# EAGLE design THAT15xx_lean (EAGLE 9.6.2)
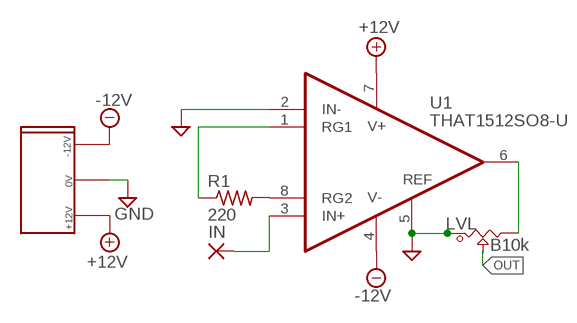
[diagram p0: schematic, sheet 1]

## Parts
IN  WIREPADSMD5-1,8  [5-1,8]
LVL  B10k  POT_9MM_SMD  [POT_9MM_SMD]
R1  220  R-US_R0603  [R0603]
U1  THAT1512SO8-U  [SO08]
U$1  EURO_POW_CEH  [EURO_POW_CEH]

## Nets
15XXO: LVL.3 U1.6(OUT)
+12V: U1.7(V+) U$1.+12V
-12V: U1.4(V-) U$1.-12V
GND: LVL.1 U1.2(IN-) U1.5(REF) U$1.GND
IN: IN.1(P) U1.3(IN+)
N$1: R1.2 U1.8(RG2)
N$2: R1.1 U1.1(RG1)
OUT: LVL.2

## Library data of the parts
IN = wirepad:WIREPAD: Wire PAD connect wire on PCB
LVL = Mech_BO_CE_SW:POT_9MM_SMD
R1 = adafruit:R-US_: RESISTOR, American symbol
U1 = that-corp:THAT1512: Audio Preamplifier IC, Low Noise, High Performance
U$1 = 2.54mm_PowHeader_SMD:EURO_POW_CEH: Eurorack Power Header Reduced Card Edge Surface Mount Pads

## Board
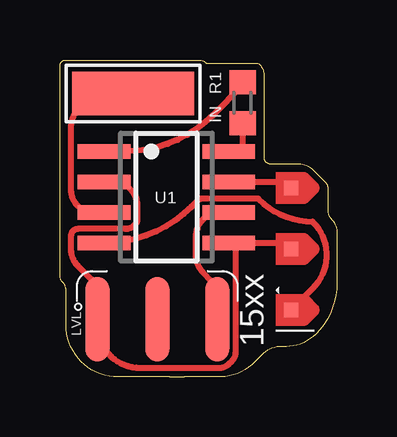
[diagram p1: board, top side]

Size 11.56 x 13.21 mm. Coordinates in mm from the lower left corner, seen from the top.
Outline: 4.57,0 5.21,0 6.72,0 arc45 8.13,0.64 8.4,0.91 arc-45 9.27,1.27 9.44,1.27 arc45 10.67,1.78 arc45 11.56,3.92 11.56,5.99 arc45 11.3,6.6 arc-45 11.18,6.91 11.18,7.87 arc45 11.09,8.09 10.67,8.51 arc45 10.05,8.89 8.76,8.89 arc-90 8.51,9.14 8.51,12.65 arc45 8.26,13.08 6.28,13.08 arc-45 6.1,13.08 arc45 5.79,13.21 0.25,13.21 arc90 0,12.95 0,4.24 arc45 0.13,3.94 arc-45 0.25,3.63 0.25,2.17 arc45 0.89,0.64 arc45 2.42,0 4.57,0
Copper layers (1*16): Top 0.035mm / dielectric 1.5mm / Bottom 0.035mm
Design rules "default *": minimum track width 6mil, minimum drill 0.35mm, track to track 6mil, track to pad 6mil, pad to pad 6mil, via to via 6mil, smd to smd 6mil, copper to edge 10mil, drill to drill 6mil, minimum pad ring 10mil, minimum via ring 8mil, stop-mask expansion 4mil, vias tented up to drill 0mil, thermal gap 10mil

### Footprints (pad centres in the part's own frame; a part is rotated, then mirrored left to right if it is on the bottom)
5-1,8 = smd 1.829 x 5.08: 1 0,0
POT_9MM_SMD = smd 0.991 x 3.505: 1 -2.5,0; 2 0,0; 3 2.5,0
R0603 = smd 1 x 1.1: 1 -0.85,0; 2 0.85,0
SO08 = smd 0.6 x 2.2: 1 -1.905,-2.6; 2 -0.635,-2.6; 3 0.635,-2.6; 4 1.905,-2.6; 5 1.905,2.6; 6 0.635,2.6; 7 -0.635,2.6; 8 -1.905,2.6
EURO_POW_CEH = smd 0.6 x 0.6: +12V 0,-3.175; -12V 5.08,-3.175; GND 2.54,-3.175

### Placement (x,y rotation side)
IN  3.05,11.81 90 top
LVL  4.06,2.41 0 top
R1  7.62,11.43 270 top
U1  4.45,7.49 270 top
U$1  12.83,7.87 270 top

### Tracks (layer width: path | path; a pad name or v marks a point on that pad's centre or on a via)
15XXO
  Top 0.254: U1.6 6.68,6.86 arc90 5.67,5.84 5.67,5.08 arc45 5.96,4.37 6.31,4.02 6.31,2.67 LVL.3
+12V
  Top 0.254: U1.7 9.4,8.13 U$1.+12V
-12V
  Top 0.254: U1.4 arc45 5.49,7.1 5.75,7.36 arc-45 5.93,7.44 8.22,7.44 arc-45 8.29,7.41 arc45 10.54,6.48 arc-90 10.54,3.68 U$1.-12V
GND
  Top 0.254: U1.5 7.37,5.59 | 7.37,5.59 9.4,5.59 U$1.GND | U1.2 2.62,8.13 3,7.75 arc-45 3.22,7.21 3.22,6.56 arc-45 3.14,6.36 3.1,6.32 arc-45 2.74,6.17 0.74,6.17 arc90 0.47,5.89 0.47,5.31 arc45 0.74,4.64 1.31,4.07 1.31,2.67 LVL.1 1.56,2.16 arc90 3.34,0.38 6.67,0.38 arc45 7.03,0.53 7.19,0.69 arc45 7.34,1.04 7.34,5.56 7.37,5.59
IN
  Top 0.254: U1.3 1.41,6.86 arc-90 0.47,7.8 0.47,10.44 arc-45 0.74,11.11 1.45,11.81 IN.1
N$1
  Top 0.254: R1.2 7.62,9.4 U1.8
N$2
  Top 0.254: R1.1 7.62,12.15 6.38,10.91 | 6.38,10.91 | 6.38,10.91 arc-45 2.73,9.4 U1.1

### Text on the board
tPlace: __ | 15xx